# Altium schematic sheet Connectors.SchDoc
size Letter; CompanyName: Ploopy Corporation; Organization: Ploopy Corporation; Address1: 137-1140 Burnhamthorpe Road W; Address2: Mississauga; Address3: Ontario; Address4: Canada L5C 0A3; DocumentNumber: 3; Revision: R2.002; SheetNumber: 3; SheetTotal: 9
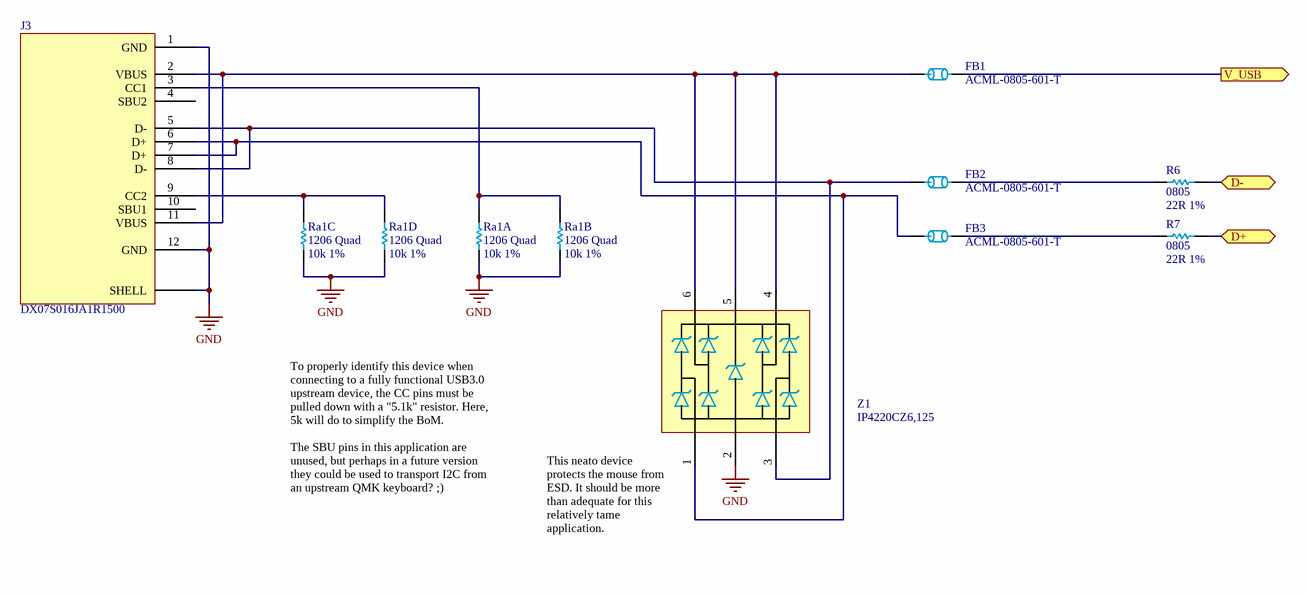
[diagram p0: Connectors.SchDoc]

## Parts
FB1  ACML-0805-601-T  [0805]
FB2  ACML-0805-601-T  [0805]
FB3  ACML-0805-601-T  [0805]
J3  DX07S016JA1R1500  [DX07S016JA1R1500]
R6  0805  value 22R 1%  [0805]
R7  0805  value 22R 1%  [0805]
Ra1  1206 Quad  value 10k 1%  [4x 10k 1% - CAC-80P320X160-8M]  (parts A,B,C,D of 4)
Z1  IP4220CZ6,125  [PESD3V3S4UD - SOT95P275X110-6N]

## Ports
D+ (bidir), D- (bidir), V_USB (out)

## Nets
GND: J3.1(GND) J3.12(GND) J3.SHELL Ra1.1 Ra1.2 Ra1.3 Ra1.4 Z1.2
D+: R7.2 ; port D+
D-: R6.2 ; port D-
V_USB: FB1.2 ; port V_USB
NetFB1_1: FB1.1 J3.2(VBUS) J3.11(VBUS) Z1.4 Z1.5 Z1.6
NetFB2_1: FB2.1 J3.5(D-) J3.8(D-) Z1.3
NetFB2_2: FB2.2 R6.1
NetFB3_1: FB3.1 J3.6(D+) J3.7(D+) Z1.1
NetFB3_2: FB3.2 R7.1
NetJ3_3: J3.3(CC1) Ra1.7 Ra1.8
NetJ3_9: J3.9(CC2) Ra1.5 Ra1.6

Not connected (* = marked no-connect by the designer): J3 4(SBU2) 10(SBU1)

## Notes on the sheet
- To properly identify this device when connecting to a fully functional USB3.0 upstream device, the CC pins must be pulled down with a "5.1k" resistor. Here, 5k will do to simplify the BoM.
  The SBU pins in this application are unused, but perhaps in a future version they could be used to transport I2C from an upstream QMK keyboard? ;)
- (near Z1) This neato device protects the mouse from ESD. It should be more than adequate for this relatively tame application.
- Copyright Ploopy Corporation
- Licensed under the CERN-OHL-S v2
- http://ohwr.org/cernohl
- Title:
- PCB:
- Version:
- Ploopy Corporation
- Mississauga ON L5C 0A3
- 137-1140 Burnhamthorpe Road W
- Date:
- Time:
- Sheet
- of
- Canada

## Library data of the parts
FB1-FB3 = ACML-0805-601-T: FERRITE BEAD 600 OHM 0805 1LN; Value: Ferrite Bead 600R; Supplier 1: Digi-Key; Supplier Part Number 1: 535-12556-1-ND
J3 = DX07S016JA1R1500: USB-C (USB TYPE-C) USB 2.0 Receptacle Connector 24 (16+8 Dummy) Position Surface Mount, Right Angle; Through Hole; Supplier 1: Digi-Key; Supplier 2: Mouser; Supplier Part Number 1: 670-DX07S016JA1R1500CT-ND; Supplier Part Number 2: 656-DX07S016JA1R1500
R6 R7 = Res 22R 1% 0805: Chip resistor; Supplier 1: Digi-Key; Supplier 2: Arrow; Supplier Part Number 1: RMCF0805FT22R0CT-ND; Supplier Part Number 2: RMCF0805FT22R0
Ra1 = Quad Res 10k 1% 1206: Chip resistor
Z1 = IP4220CZ6,125: TVS DIODE 5.5V 6TSOP (Low capacitance, USB); Supplier 1: Digi-Key; Supplier 2: Mouser; Supplier 3: Arrow; Supplier Part Number 1: 1727-3578-1-ND; Supplier Part Number 2: 771-IP4220CZ6-T/R; Supplier Part Number 3: IP4220CZ6,125